# Altium schematic sheet Cape Overview.SchDoc: Rock960 Cape Overview
size B; CompanyName: Drexel University; Organization: Drexel University; Address1: ECE Senior Design; Address2: 2018-2019; Address3: ECE-08; Revision: 1.0; SheetNumber: 1; SheetTotal: 9; ProjectName: Rock960 Cape
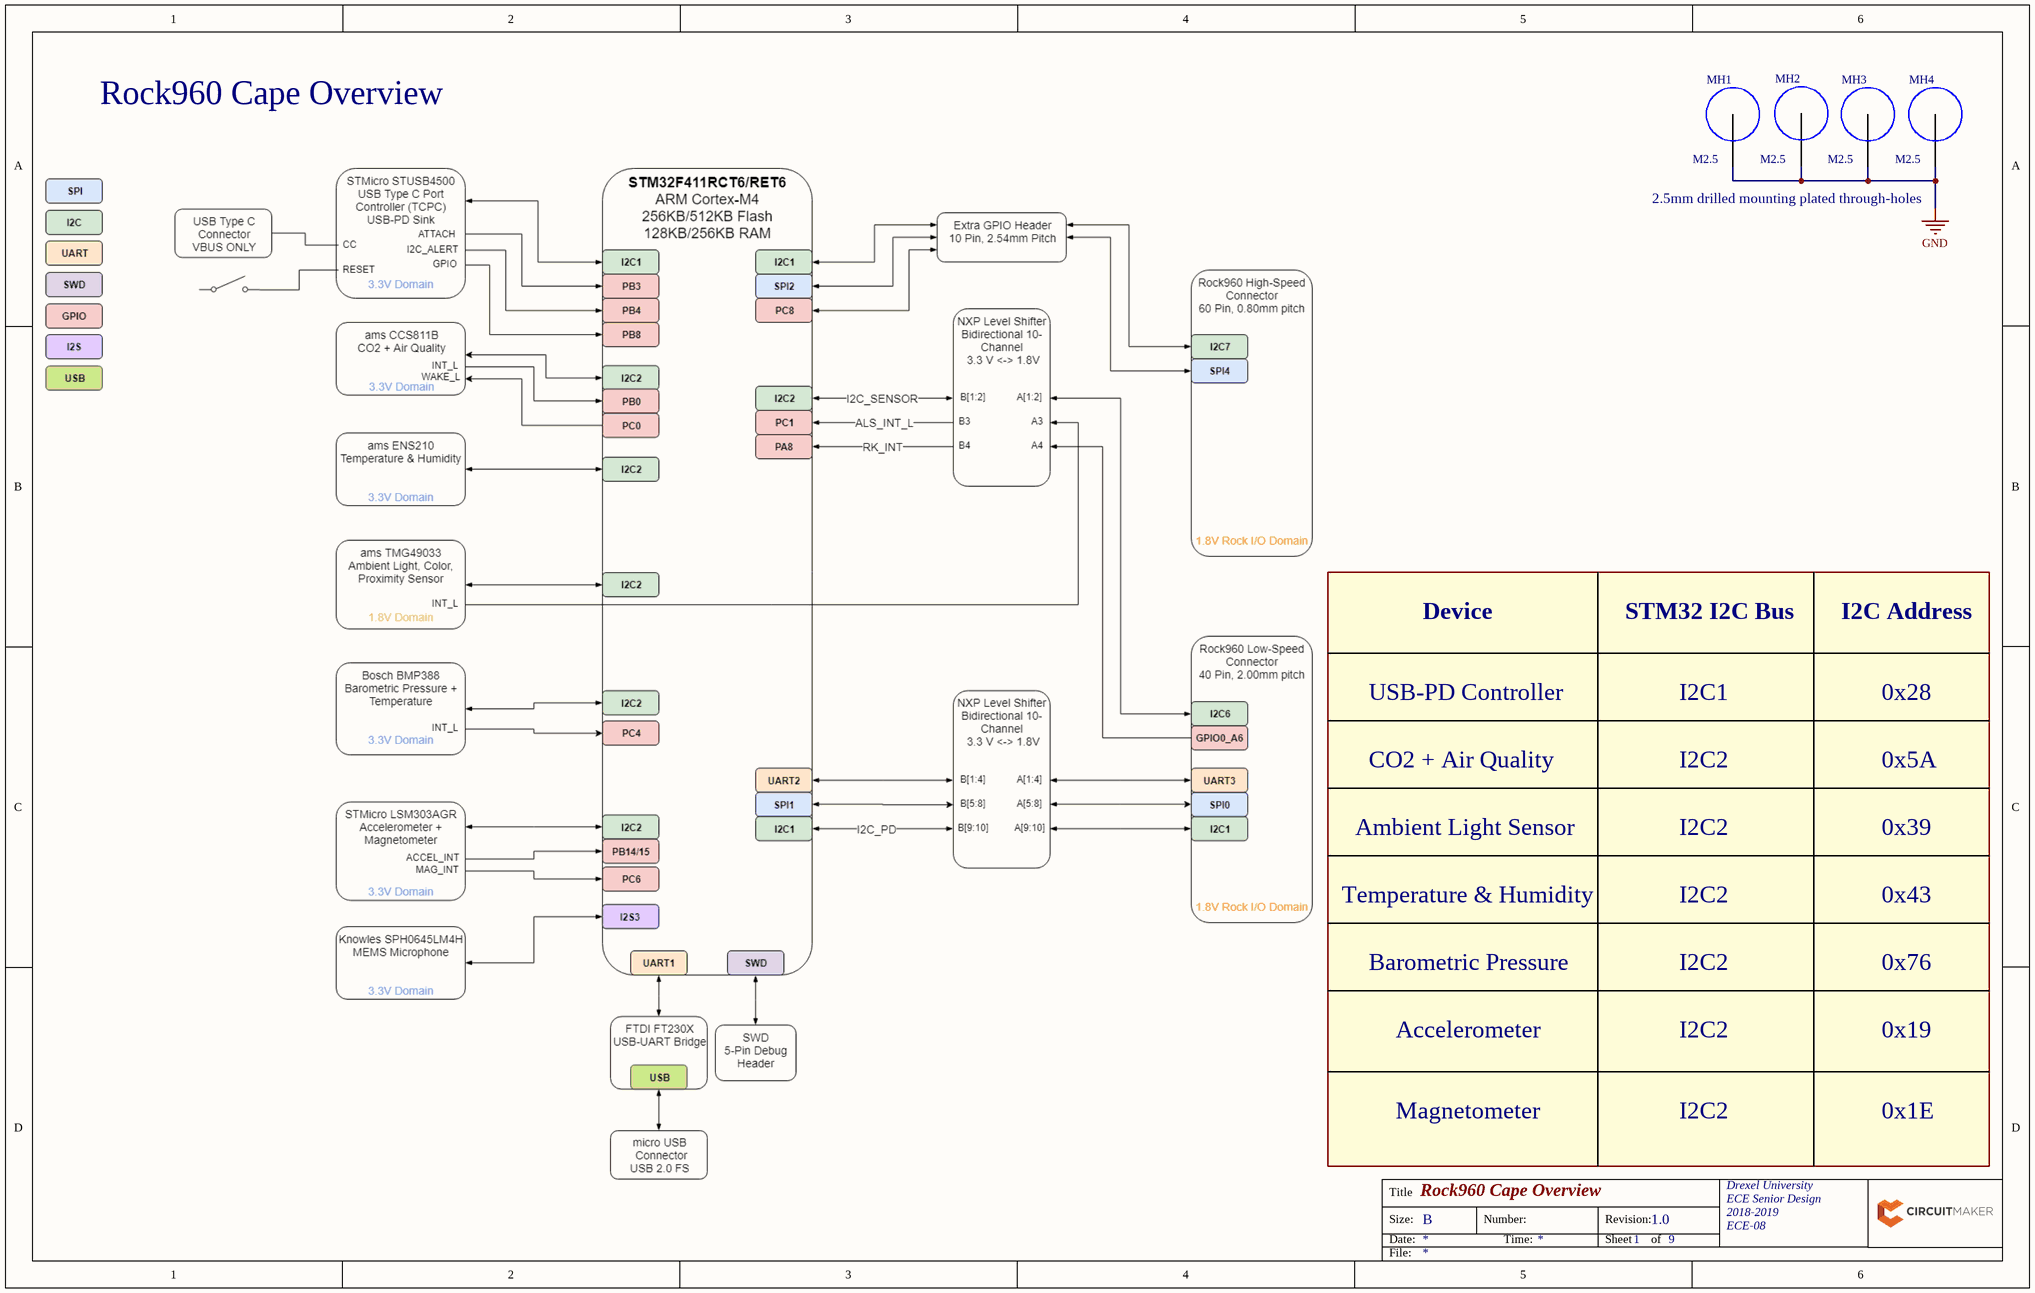
[diagram p0: Cape Overview.SchDoc]

## Parts
MH1  M2.5  [PCB-cs3sr3addcss8sioosoo-1]
MH2  M2.5  [PCB-cs3sr3addcss8sioosoo-1]
MH3  M2.5  [PCB-cs3sr3addcss8sioosoo-1]
MH4  M2.5  [PCB-cs3sr3addcss8sioosoo-1]

## Nets
GND: MH1.1 MH2.1 MH3.1 MH4.1

## Notes on the sheet
- Rock960 Cape Overview
- 2.5mm drilled mounting plated through-holes
- Device
- STM32 I2C Bus
- I2C Address
- USB-PD Controller
- I2C1
- 0x28
- CO2 + Air Quality
- I2C2
- 0x5A
- Ambient Light Sensor
- 0x39
- Temperature & Humidity
- 0x43
- Barometric Pressure
- 0x76
- Accelerometer
- 0x19
- Magnetometer
- 0x1E
- Title
- Size:
- Date:
- B
- Number:
- Time:
- Revision:
- Sheet
- of
- File:

## Library data of the parts
MH1-MH4 = CMP-yzeggvgux1nyfm6m4i34-1: Plated Through-Hole Mechanical, 2.5mm drilled, 5.0mm diameter; CustomComponentID: yzeggvgux1nyfm6m4i34